# EAGLE schematic 8_step_sequencer (EAGLE 5.10)
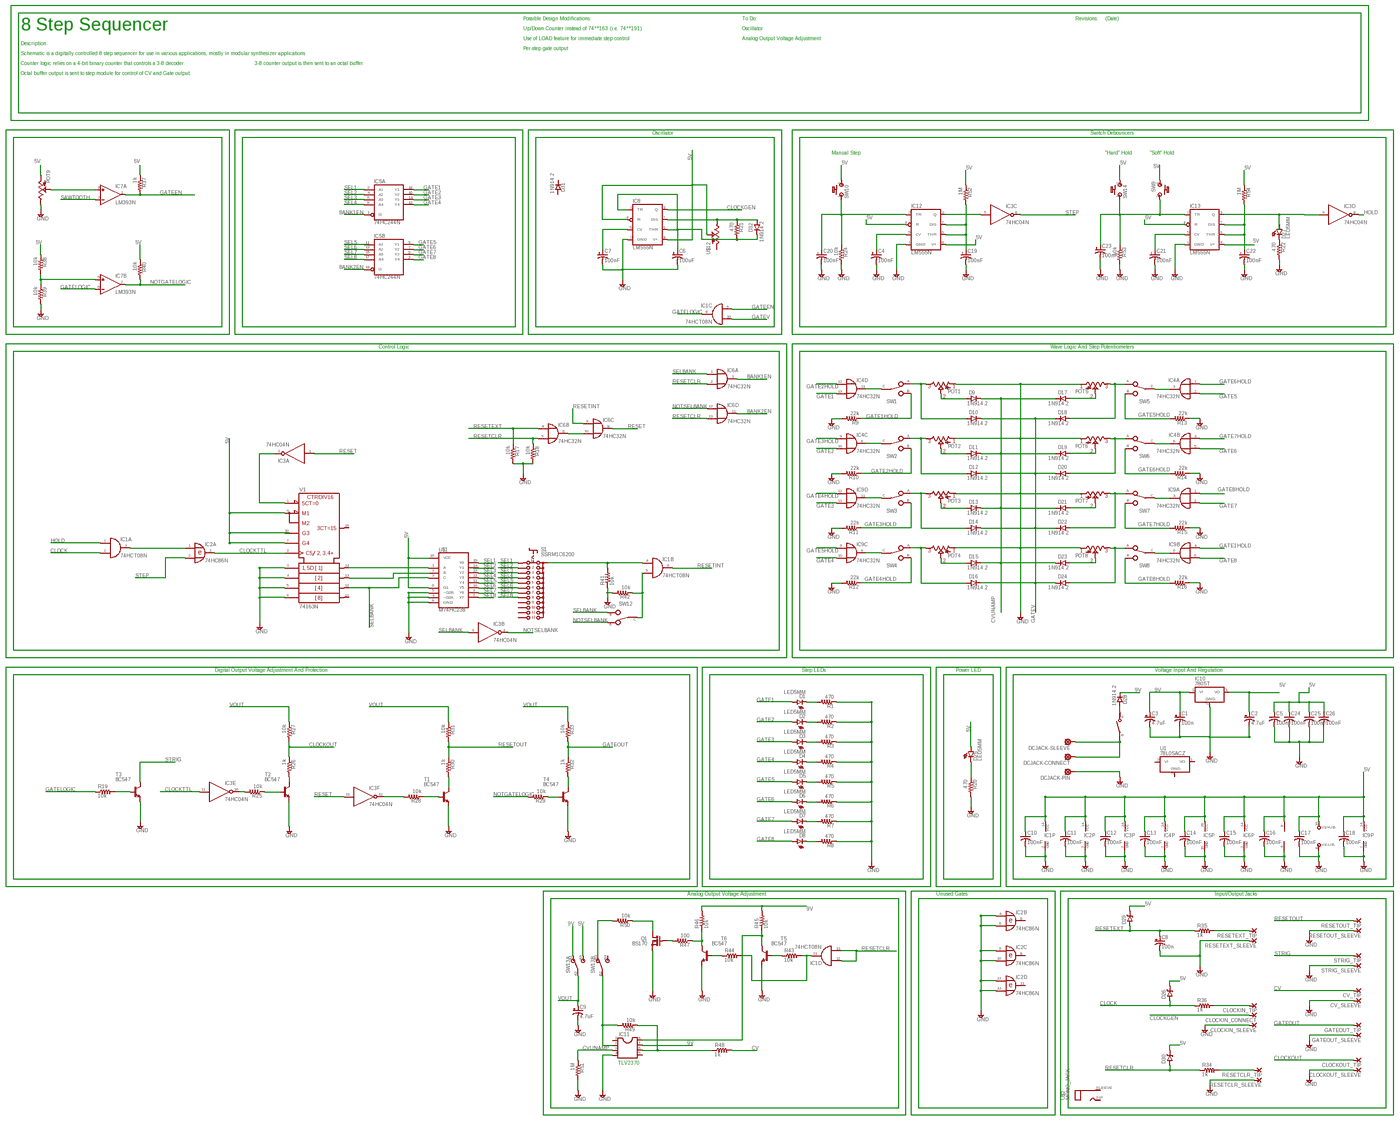
[diagram p0: schematic, sheet 1, overview]
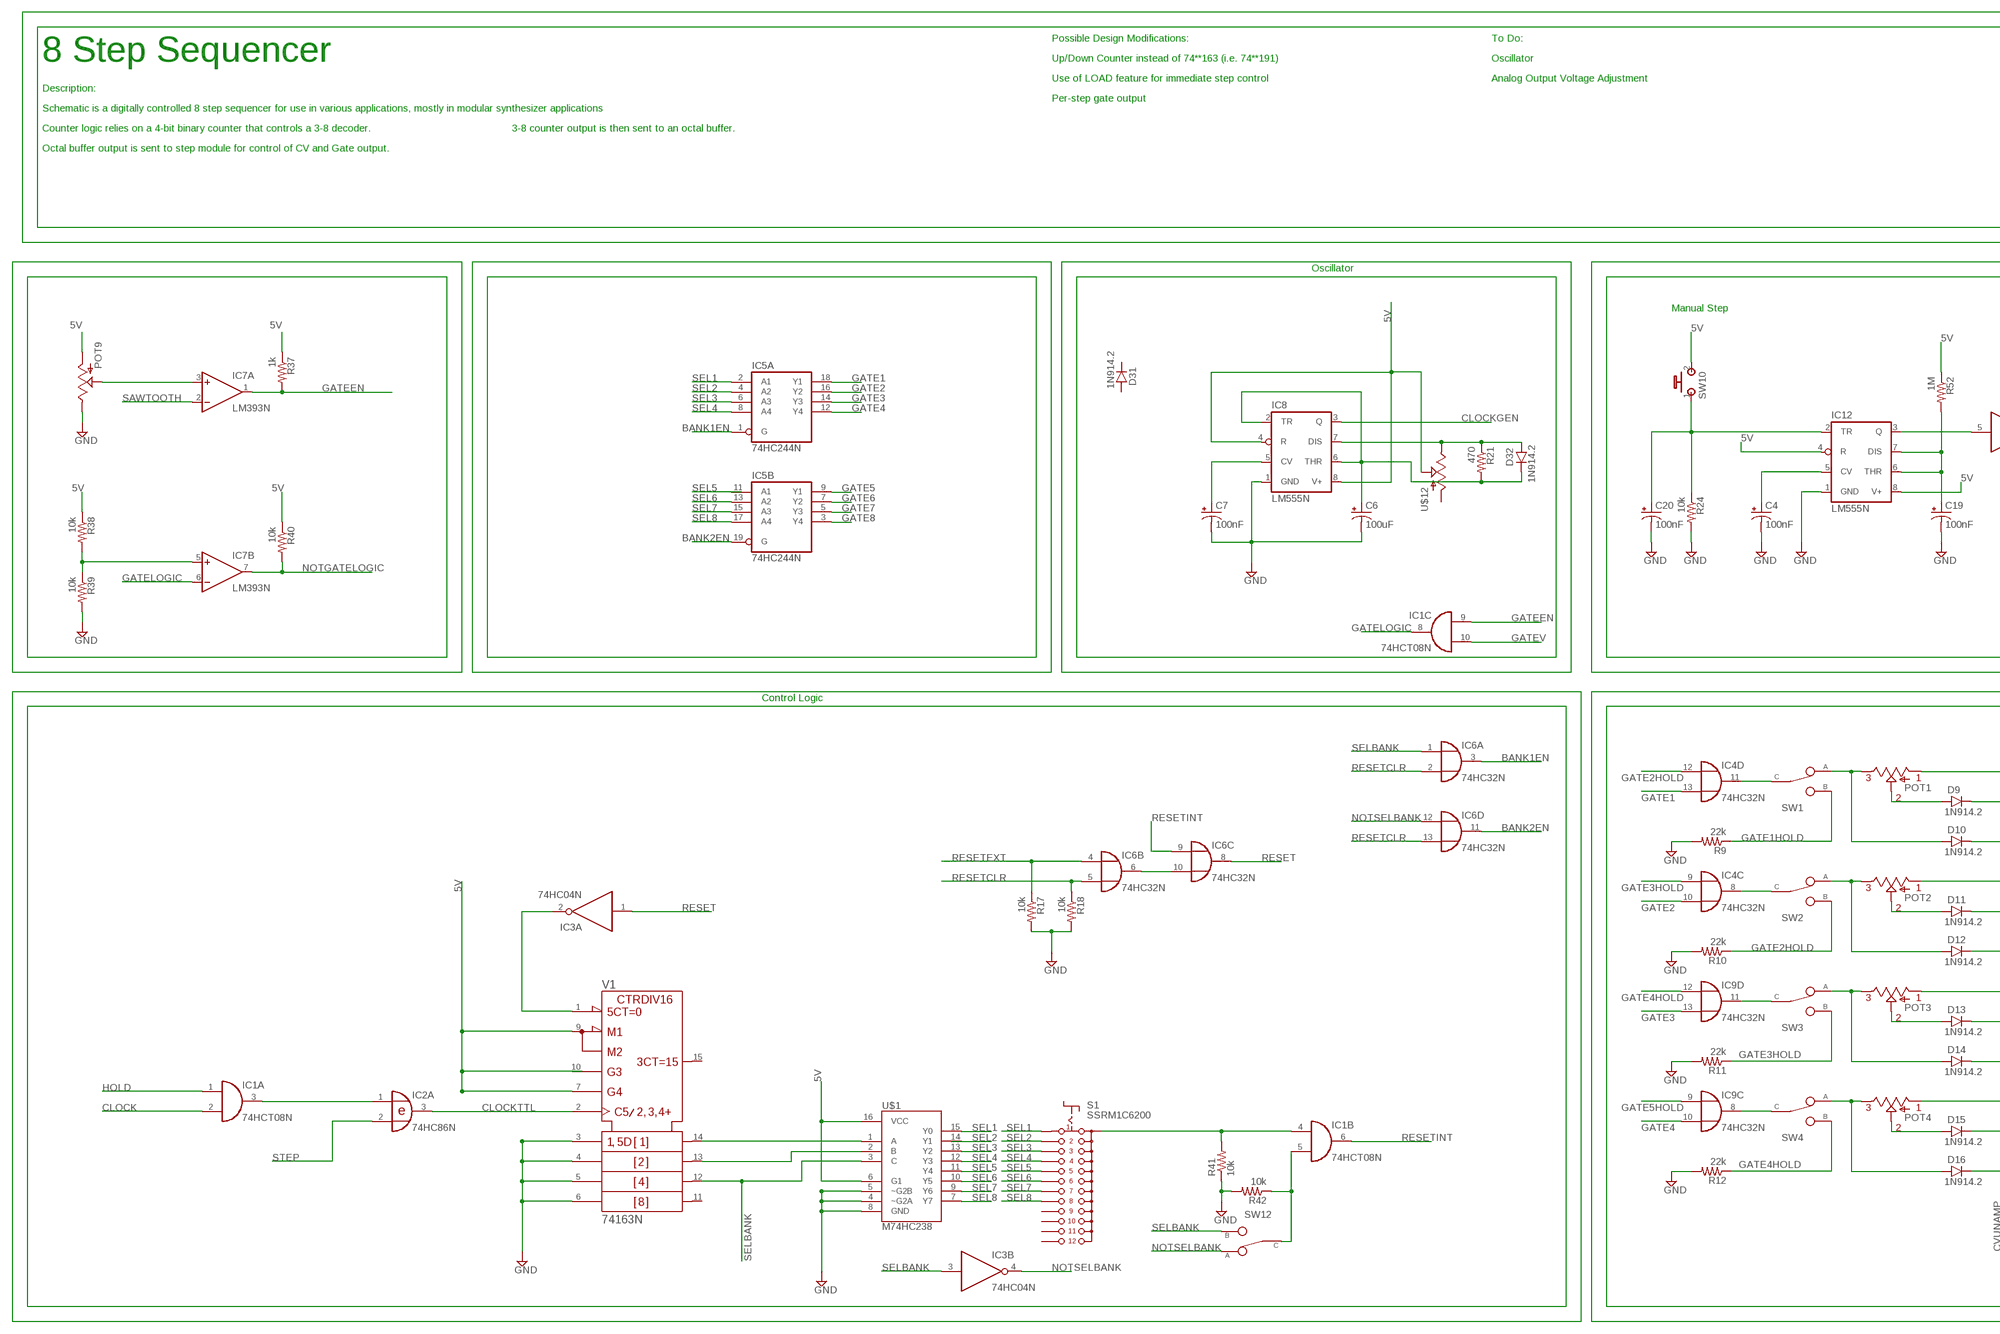
[diagram p1: schematic, sheet 1, part 1 of 4]
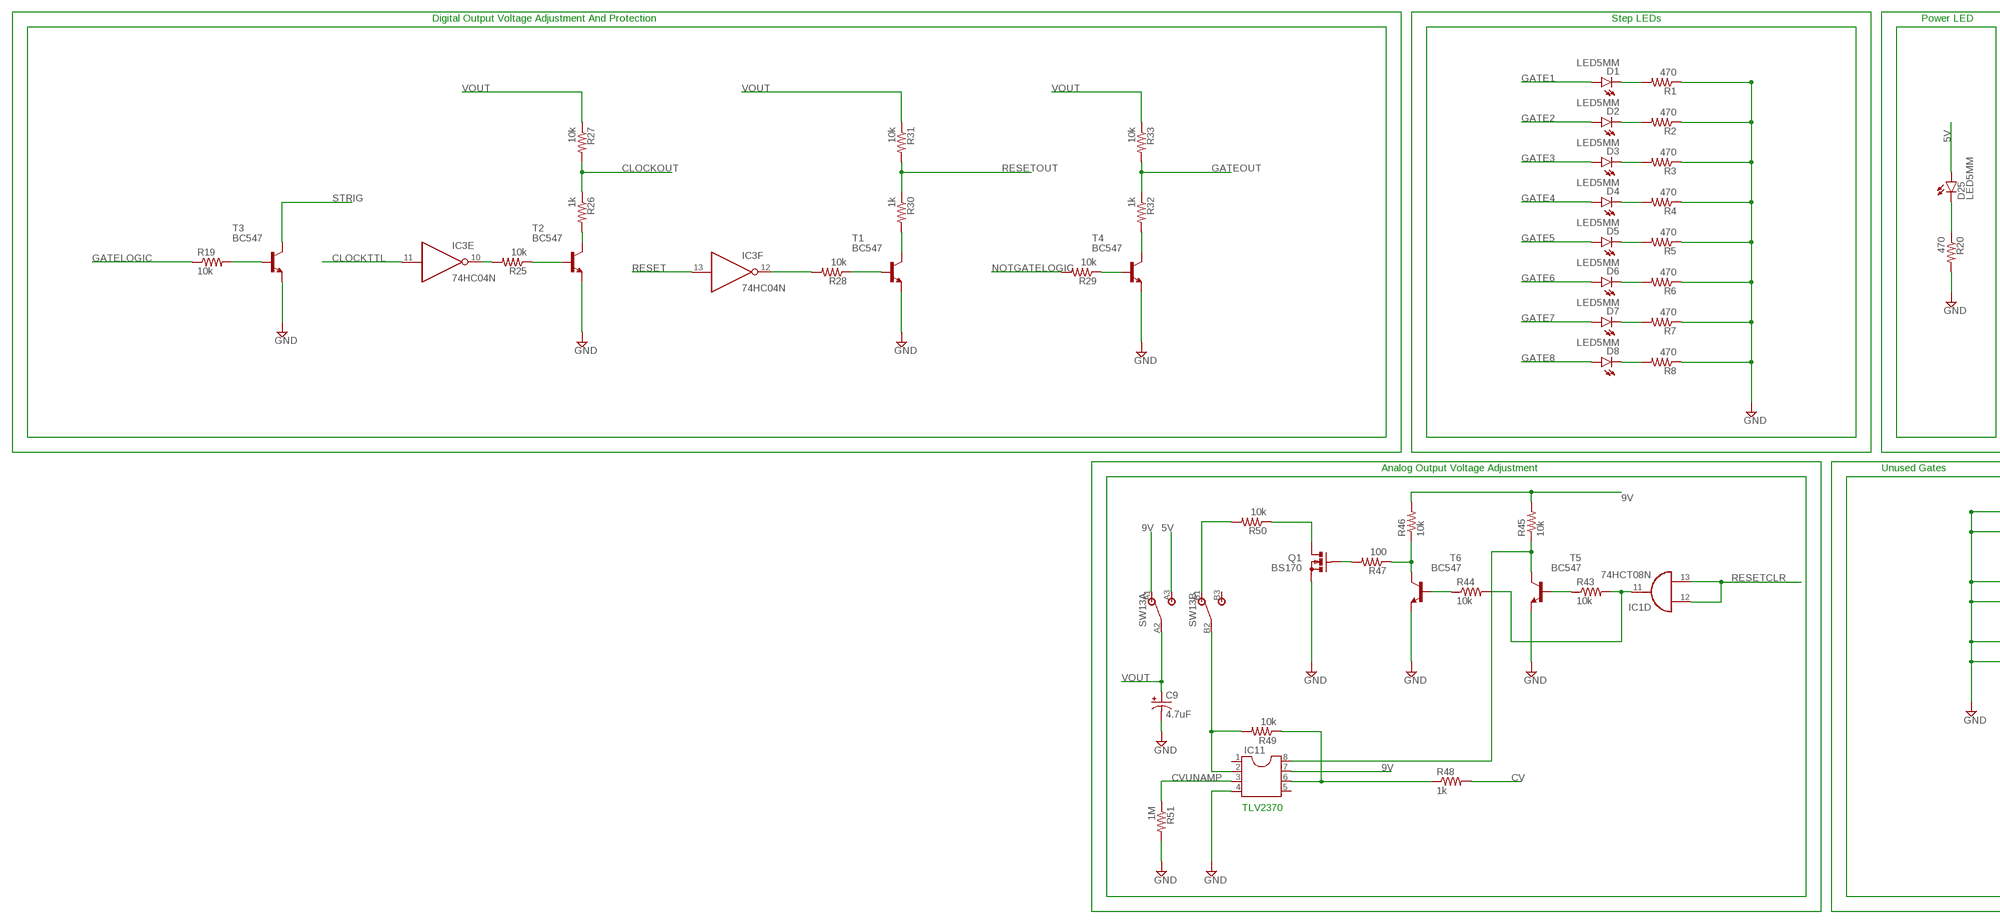
[diagram p2: schematic, sheet 1, part 2 of 4]
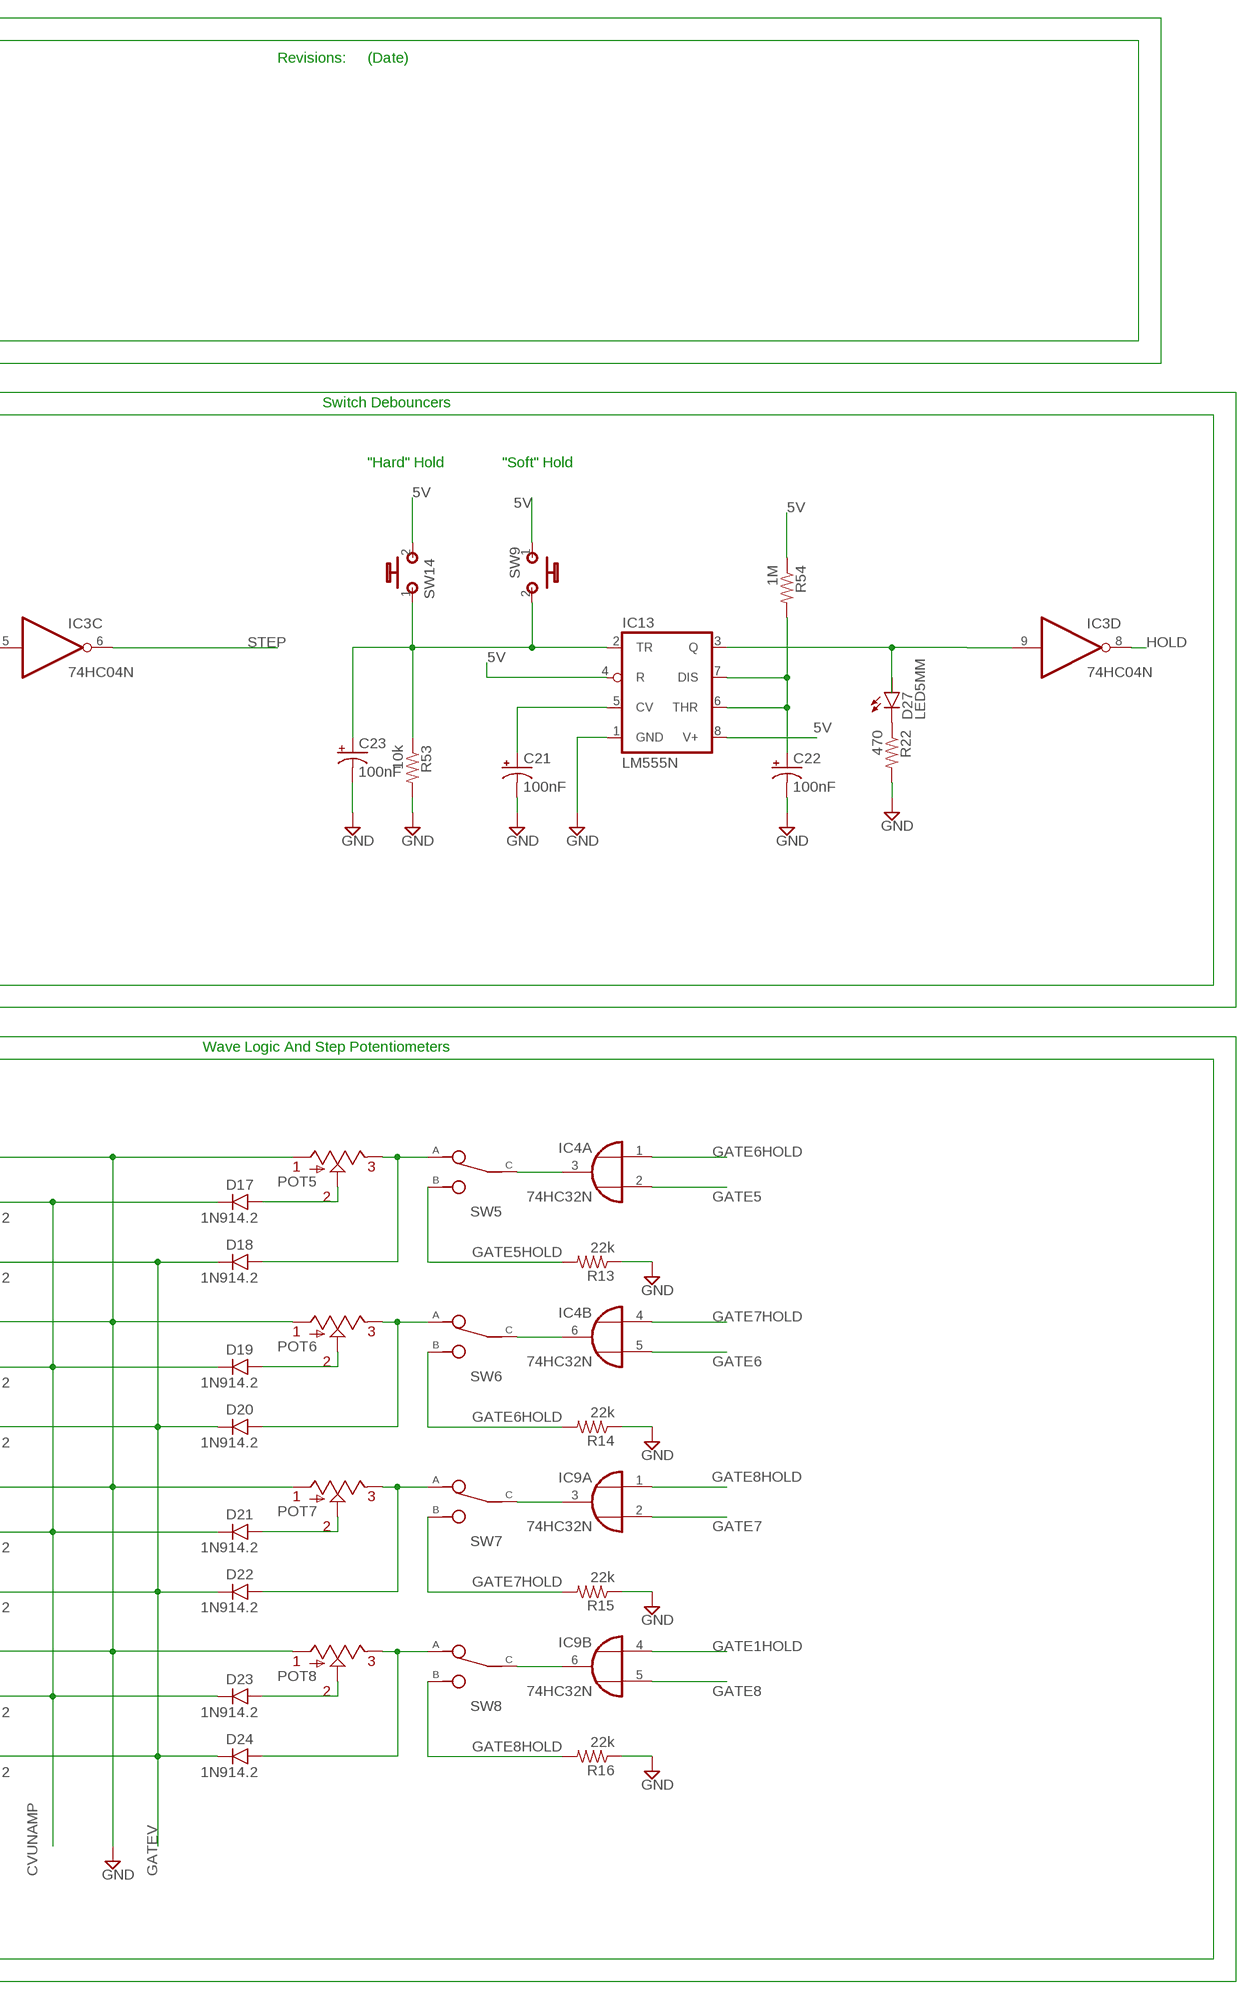
[diagram p3: schematic, sheet 1, part 3 of 4]
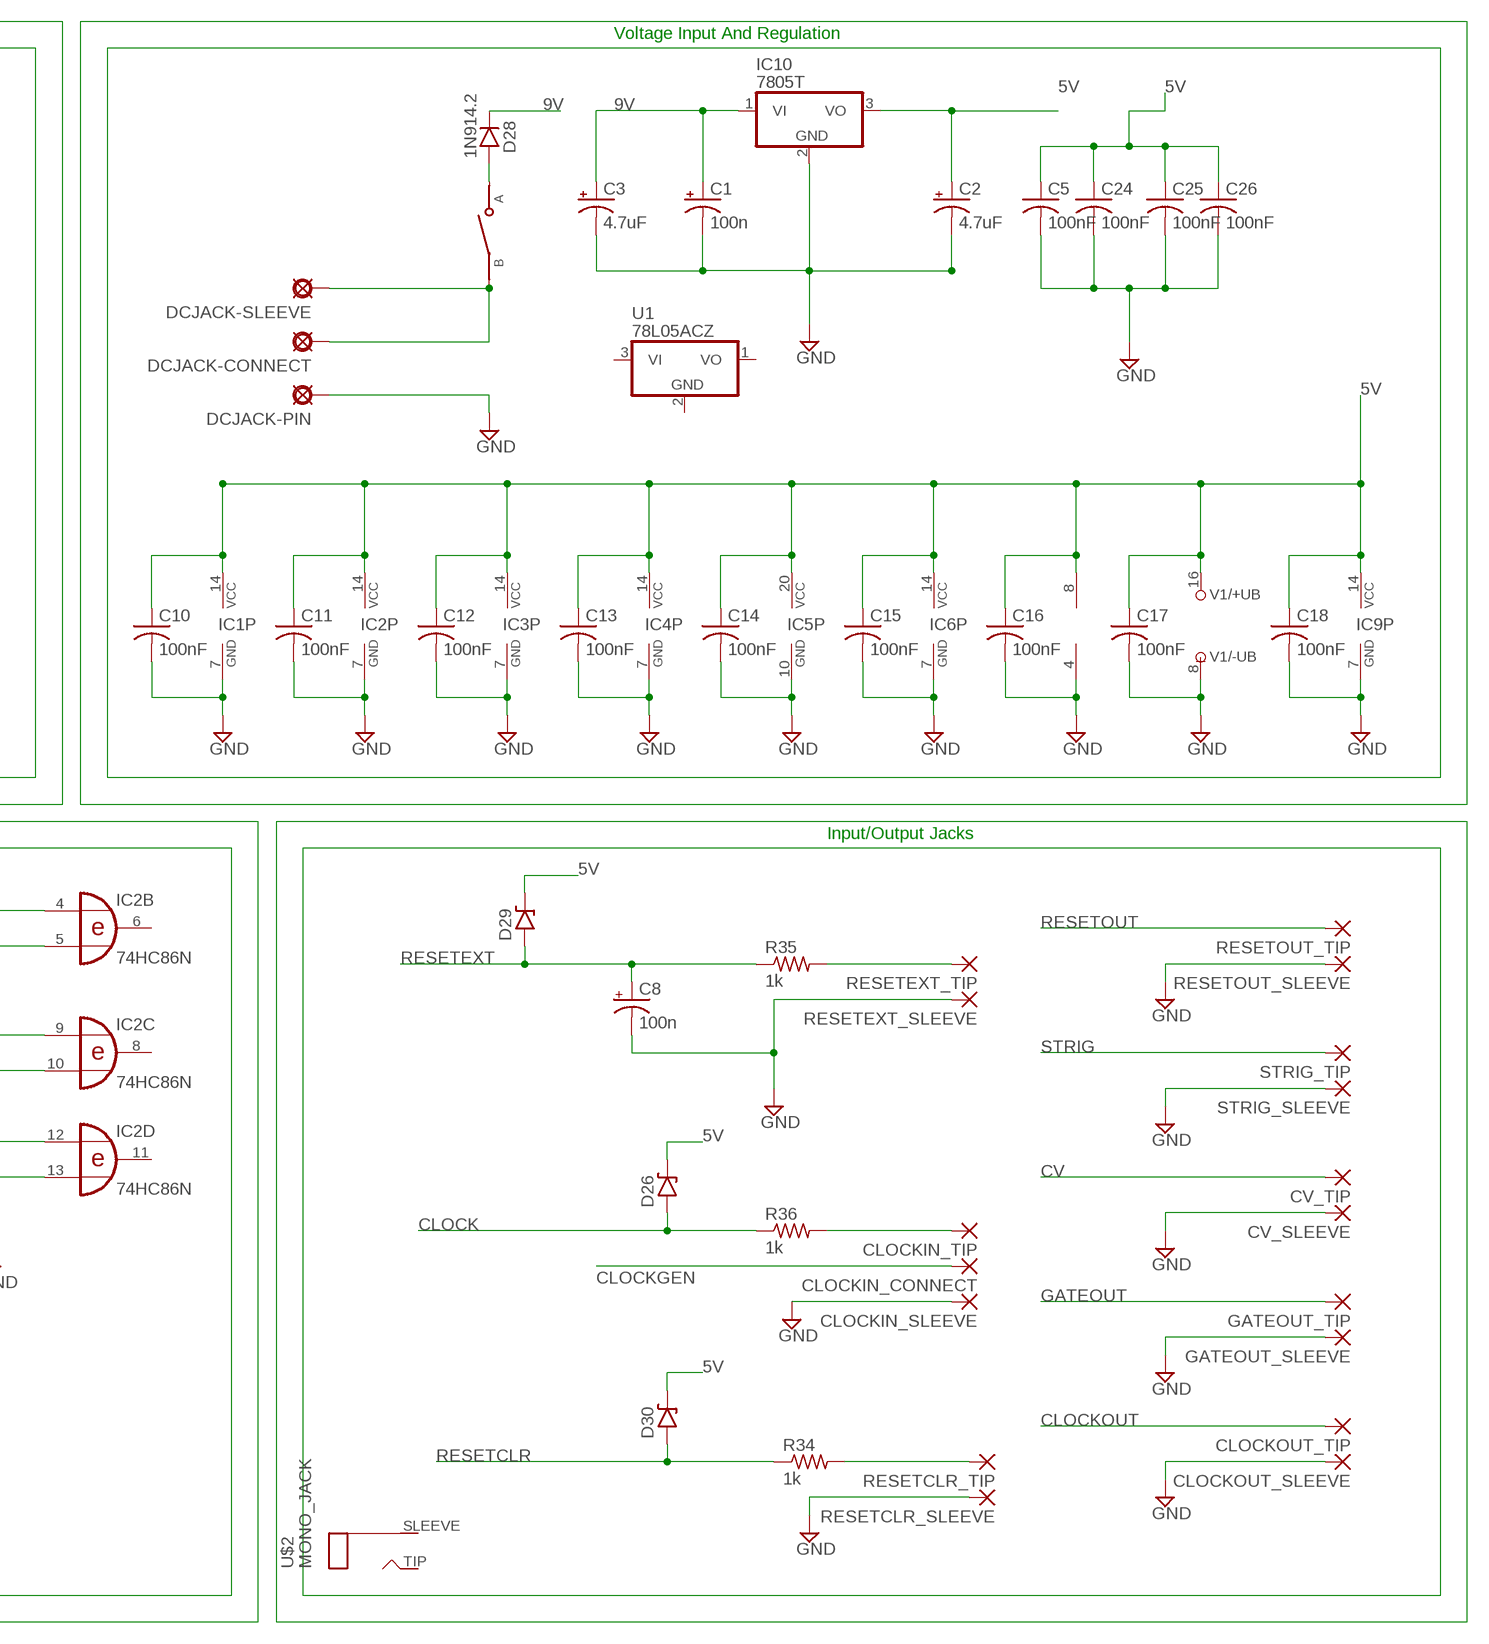
[diagram p4: schematic, sheet 1, part 4 of 4]

## Parts
C1  100n  0501  [050_020_1]
C2  4.7uF  0501  [050_020_1]
C3  4.7uF  0501  [050_020_1]
C4  100nF  0501  [050_020_1]
C5  100nF  C-US050-025X075  [C050-025X075]
C6  100uF  0501  [050_020_1]
C7  100nF  0501  [050_020_1]
C8  100n  0501  [050_020_1]
C9  4.7uF  0501  [050_020_1]
C10  100nF  C-US050-025X075  [C050-025X075]
C11  100nF  C-US050-025X075  [C050-025X075]
C12  100nF  C-US050-025X075  [C050-025X075]
C13  100nF  C-US050-025X075  [C050-025X075]
C14  100nF  C-US050-025X075  [C050-025X075]
C15  100nF  C-US050-025X075  [C050-025X075]
C16  100nF  C-US050-025X075  [C050-025X075]
C17  100nF  C-US050-025X075  [C050-025X075]
C18  100nF  C-US050-025X075  [C050-025X075]
C19  100nF  0501  [050_020_1]
C20  100nF  0501  [050_020_1]
C21  100nF  0501  [050_020_1]
C22  100nF  0501  [050_020_1]
C23  100nF  0501  [050_020_1]
C24  100nF  C-US050-025X075  [C050-025X075]
C25  100nF  C-US050-025X075  [C050-025X075]
C26  100nF  C-US050-025X075  [C050-025X075]
CLOCKIN_CONNECT  3,81/1,4  [3,81/1,4]
CLOCKIN_SLEEVE  3,81/1,4  [3,81/1,4]
CLOCKIN_TIP  3,81/1,4  [3,81/1,4]
CLOCKOUT_SLEEVE  3,81/1,4  [3,81/1,4]
CLOCKOUT_TIP  3,81/1,4  [3,81/1,4]
CV_SLEEVE  3,81/1,4  [3,81/1,4]
CV_TIP  3,81/1,4  [3,81/1,4]
D1  LED5MM  [LED5MM]
D2  LED5MM  [LED5MM]
D3  LED5MM  [LED5MM]
D4  LED5MM  [LED5MM]
D5  LED5MM  [LED5MM]
D6  LED5MM  [LED5MM]
D7  LED5MM  [LED5MM]
D8  LED5MM  [LED5MM]
D9  1N914.2  [DO35-2]
D10  1N914.2  [DO35-2]
D11  1N914.2  [DO35-2]
D12  1N914.2  [DO35-2]
D13  1N914.2  [DO35-2]
D14  1N914.2  [DO35-2]
D15  1N914.2  [DO35-2]
D16  1N914.2  [DO35-2]
D17  1N914.2  [DO35-2]
D18  1N914.2  [DO35-2]
D19  1N914.2  [DO35-2]
D20  1N914.2  [DO35-2]
D21  1N914.2  [DO35-2]
D22  1N914.2  [DO35-2]
D23  1N914.2  [DO35-2]
D24  1N914.2  [DO35-2]
D25  LED5MM  [LED5MM]
D26  1N9ZENER  [DO35-3]
D27  LED5MM  [LED5MM]
D28  1N914.2  [DO35-2]
D29  1N9ZENER  [DO35-3]
D30  1N9ZENER  [DO35-3]
D31  1N914.2  [DO35-2]
D32  1N914.2  [DO35-2]
DCJACK-CONNECT  PAD  [SQUARE]
DCJACK-PIN  PAD8  [OCTOGON]
DCJACK-SLEEVE  PAD  [SQUARE]
GATEOUT_SLEEVE  3,81/1,4  [3,81/1,4]
GATEOUT_TIP  3,81/1,4  [3,81/1,4]
IC1  74HCT08N  [DIL14]
IC2  74HC86N  [DIL14]
IC3  74HC04N  [DIL14]
IC4  74HC32N  [DIL14]
IC5  74HC244N  [DIL20]
IC6  74HC32N  [DIL14]
IC7  LM393N  [DIL08]
IC8  LM555N  [DIL08]
IC9  74HC32N  [DIL14]
IC10  7805T  [TO220H]
IC11  DIL8  [DIL08]
IC12  LM555N  [DIL08]
IC13  LM555N  [DIL08]
POT1  POT  [POT]
POT2  POT  [POT]
POT3  POT  [POT]
POT4  POT  [POT]
POT5  POT  [POT]
POT6  POT  [POT]
POT7  POT  [POT]
POT8  POT  [POT]
POT9  POT  [ALPS_POT]
Q1  BS170  [SOT54ES]
R1  470  3MM.2  [R0204/2]
R2  470  3MM.2  [R0204/2]
R3  470  3MM.2  [R0204/2]
R4  470  3MM.2  [R0204/2]
R5  470  3MM.2  [R0204/2]
R6  470  3MM.2  [R0204/2]
R7  470  3MM.2  [R0204/2]
R8  470  3MM.2  [R0204/2]
R9  22k  3MM.2  [R0204/2]
R10  22k  3MM.2  [R0204/2]
R11  22k  3MM.2  [R0204/2]
R12  22k  3MM.2  [R0204/2]
R13  22k  3MM.2  [R0204/2]
R14  22k  3MM.2  [R0204/2]
R15  22k  3MM.2  [R0204/2]
R16  22k  3MM.2  [R0204/2]
R17  10k  3MM.2  [R0204/2]
R18  10k  3MM.2  [R0204/2]
R19  10k  3MM.2  [R0204/2]
R20  470  3MM.2  [R0204/2]
R21  470  3MM.2  [R0204/2]
R22  470  3MM.2  [R0204/2]
R24  10k  3MM.2  [R0204/2]
R25  10k  3MM.2  [R0204/2]
R26  1k  3MM.2  [R0204/2]
R27  10k  3MM.2  [R0204/2]
R28  10k  3MM.2  [R0204/2]
R29  10k  3MM.2  [R0204/2]
R30  1k  3MM.2  [R0204/2]
R31  10k  3MM.2  [R0204/2]
R32  1k  3MM.2  [R0204/2]
R33  10k  3MM.2  [R0204/2]
R34  1k  3MM.2  [R0204/2]
R35  1k  3MM.2  [R0204/2]
R36  1k  3MM.2  [R0204/2]
R37  1k  3MM.2  [R0204/2]
R38  10k  3MM.2  [R0204/2]
R39  10k  3MM.2  [R0204/2]
R40  10k  3MM.2  [R0204/2]
R41  10k  3MM.2  [R0204/2]
R42  10k  3MM.2  [R0204/2]
R43  10k  3MM.2  [R0204/2]
R44  10k  3MM.2  [R0204/2]
R45  10k  3MM.2  [R0204/2]
R46  10k  3MM.2  [R0204/2]
R47  100  3MM.2  [R0204/2]
R48  1k  3MM.2  [R0204/2]
R49  10k  3MM.2  [R0204/2]
R50  10k  3MM.2  [R0204/2]
R51  1M  3MM.2  [R0204/2]
R52  1M  3MM.2  [R0204/2]
R53  10k  3MM.2  [R0204/2]
R54  1M  3MM.2  [R0204/2]
RESETCLR_SLEEVE  3,81/1,4  [3,81/1,4]
RESETCLR_TIP  3,81/1,4  [3,81/1,4]
RESETEXT_SLEEVE  3,81/1,4  [3,81/1,4]
RESETEXT_TIP  3,81/1,4  [3,81/1,4]
RESETOUT_SLEEVE  3,81/1,4  [3,81/1,4]
RESETOUT_TIP  3,81/1,4  [3,81/1,4]
S1  SSRM1C6200  [SSRM1C6200]
STRIG_SLEEVE  3,81/1,4  [3,81/1,4]
STRIG_TIP  3,81/1,4  [3,81/1,4]
SW1  SPDT_SWITCH  [SPDT_TOGGLE_SWITCH]
SW2  SPDT_SWITCH  [SPDT_TOGGLE_SWITCH]
SW3  SPDT_SWITCH  [SPDT_TOGGLE_SWITCH]
SW4  SPDT_SWITCH  [SPDT_TOGGLE_SWITCH]
SW5  SPDT_SWITCH  [SPDT_TOGGLE_SWITCH]
SW6  SPDT_SWITCH  [SPDT_TOGGLE_SWITCH]
SW7  SPDT_SWITCH  [SPDT_TOGGLE_SWITCH]
SW8  SPDT_SWITCH  [SPDT_TOGGLE_SWITCH]
SW9  MOMENTARY  [SPST]
SW10  MOMENTARY  [SPST]
SW11  SPST_SWITCH  [SPST_TOGGLE_SWITCH]
SW12  SPDT_SWITCH  [SPDT_TOGGLE_SWITCH]
SW13  DPDT  [DPDT]
SW14  MOMENTARY  [SPST]
T1  BC547  [TO92]
T2  BC547  [TO92]
T3  BC547  [TO92]
T4  BC547  [TO92]
T5  BC547  [TO92]
T6  BC547  [TO92]
U1  78L05ACZ  [TO-92]
U$1  M74HC238  [DIL16]
U$2  MONO_JACK  [MONO_JACK]
U$12  POT  [ALPS_POT]
V1  74163N  [DIL16]

## Nets
5V: C2.+ C5.1 C10.1 C11.1 C12.1 C13.1 C14.1 C15.1 C16.1 C17.1 C18.1 C24.1 C25.1 C26.1 D25.A D26.C D29.C D30.C IC1.14(P:VCC) IC2.14(P:VCC) IC3.14(P:VCC) IC4.14(P:VCC) IC5.20(P:VCC) IC6.14(P:VCC) IC7.8(P:V+) IC8.4(R) IC8.8(V+) IC9.14(P:VCC) IC10.3(VO) IC12.4(R) IC12.8(V+) IC13.4(R) IC13.8(V+) POT9.P$3(A) R37.1 R38.1 R40.1 R52.1 R54.1 SW9.1(P) SW10.2(S) SW13.A3 SW14.2(S) U$1.6(G1) U$1.16(VCC) U$12.P$2(S) V1.7(ENP) V1.9(!LOAD) V1.10(ENT) V1.16(+UB)
9V: C1.+ C3.+ D28.C IC10.1(VI) IC11.7 R45.2 R46.2 SW13.A1
9V_IN: DCJACK-CONNECT.1(PAD) DCJACK-SLEEVE.1(PAD) SW11.B
A: U$1.1(A) V1.14(QA)
B: U$1.2(B) V1.13(QB)
BANK1EN: IC5.1(A:G) IC6.3(A:O)
BANK2EN: IC5.19(B:G) IC6.11(D:O)
CLOCK: D26.A IC1.2(A:I1) R36.1
CLOCKGEN: CLOCKIN_CONNECT.1(P) IC8.3(Q)
CLOCKOUT: CLOCKOUT_TIP.1(P) R26.1 R27.2
CLOCKTTL: IC2.3(A:O) IC3.11(E:I) V1.2(CLK)
CV: CV_TIP.1(P) R48.2
CVUNAMP: D9.C D11.C D13.C D15.C D17.C D19.C D21.C D23.C IC11.3 R51.1
GATE1: D1.A IC4.13(D:I1) IC5.18(A:Y1)
GATE1HOLD: IC9.4(B:I0) R9.1 SW1.B
GATE2: D2.A IC4.10(C:I1) IC5.16(A:Y2)
GATE2HOLD: IC4.12(D:I0) R10.1 SW2.B
GATE3: D3.A IC5.14(A:Y3) IC9.13(D:I1)
GATE3HOLD: IC4.9(C:I0) R11.1 SW3.B
GATE4: D4.A IC5.12(A:Y4) IC9.10(C:I1)
GATE4HOLD: IC9.12(D:I0) R12.1 SW4.B
GATE5: D5.A IC4.2(A:I1) IC5.9(B:Y1)
GATE5HOLD: IC9.9(C:I0) R13.2 SW5.B
GATE6: D6.A IC4.5(B:I1) IC5.7(B:Y2)
GATE6HOLD: IC4.1(A:I0) R14.2 SW6.B
GATE7: D7.A IC5.5(B:Y3) IC9.2(A:I1)
GATE7HOLD: IC4.4(B:I0) R15.2 SW7.B
GATE8: D8.A IC5.3(B:Y4) IC9.5(B:I1)
GATE8HOLD: IC9.1(A:I0) R16.2 SW8.B
GATEEN: IC1.9(C:I0) IC7.1(A:OUT) R37.2
GATELOGIC: IC1.8(C:O) IC7.6(B:-IN) R19.1
GATEOUT: GATEOUT_TIP.1(P) R32.1 R33.2
GATEV: D10.C D14.C D16.C D18.C D20.C D22.C D24.C IC1.10(C:I1)
GND: C1.- C2.- C3.- C4.- C5.2 C6.- C7.- C8.- C9.- C10.2 C11.2 C12.2 C13.2 C14.2 C15.2 C16.2 C17.2 C18.2 C19.- C20.- C21.- C22.- C23.- C24.2 C25.2 C26.2 CLOCKIN_SLEEVE.1(P) CLOCKOUT_SLEEVE.1(P) CV_SLEEVE.1(P) DCJACK-PIN.1(PAD) GATEOUT_SLEEVE.1(P) IC1.7(P:GND) IC2.4(B:I0) IC2.5(B:I1) IC2.7(P:GND) IC2.9(C:I0) IC2.10(C:I1) IC2.12(D:I0) IC2.13(D:I1) IC3.7(P:GND) IC4.7(P:GND) IC5.10(P:GND) IC6.7(P:GND) IC7.4(P:V-) IC8.1(GND) IC9.7(P:GND) IC10.2(GND) IC11.4 IC12.1(GND) IC13.1(GND) POT1.1 POT2.1 POT3.1 POT4.1 POT5.1 POT6.1 POT7.1 POT8.1 POT9.P$1(E) Q1.S R1.1 R2.1 R3.1 R4.1 R5.1 R6.1 R7.1 R8.1 R9.2 R10.2 R11.2 R12.2 R13.1 R14.1 R15.1 R16.1 R17.2 R18.2 R20.2 R22.2 R24.2 R39.2 R41.1 R42.2 R51.2 R53.2 RESETCLR_SLEEVE.1(P) RESETEXT_SLEEVE.1(P) RESETOUT_SLEEVE.1(P) STRIG_SLEEVE.1(P) T1.1(E) T2.1(E) T3.1(E) T4.1(E) T5.1(E) T6.1(E) U$1.4(~G2A) U$1.5(~G2B) U$1.8(GND) V1.3(A) V1.4(B) V1.5(C) V1.6(D) V1.8(-UB)
HOLD: IC1.1(A:I0) IC3.8(D:O)
N$1: D1.K(C) R1.2
N$2: IC4.11(D:O) SW1.C
N$3: D10.A POT1.3 SW1.A
N$4: D2.K(C) R2.2
N$5: D9.A POT1.2
N$6: R34.2 RESETCLR_TIP.1(P)
N$7: D3.K(C) R3.2
N$8: IC4.8(C:O) SW2.C
N$9: IC9.11(D:O) SW3.C
N$10: D4.K(C) R4.2
N$11: D12.A POT2.3 SW2.A
N$12: D11.A POT2.2
N$13: D5.K(C) R5.2
N$14: CLOCKIN_TIP.1(P) R36.2
N$15: D14.A POT3.3 SW3.A
N$16: D6.K(C) R6.2
N$17: D13.A POT3.2
N$18: R35.2 RESETEXT_TIP.1(P)
N$19: D7.K(C) R7.2
N$20: IC9.8(C:O) SW4.C
N$21: D16.A POT4.3 SW4.A
N$22: D8.K(C) R8.2
N$23: D15.A POT4.2
N$24: IC7.5(B:+IN) R38.2 R39.1
N$25: IC4.3(A:O) SW5.C
N$26: D18.A POT5.3 SW5.A
N$27: D17.A POT5.2
N$28: D28.A SW11.A
N$29: IC4.6(B:O) SW6.C
N$30: D20.A POT6.3 SW6.A
N$31: D19.A POT6.2
N$33: IC9.3(A:O) SW7.C
N$34: D22.A POT7.3 SW7.A
N$35: D21.A POT7.2
N$36: IC7.3(A:+IN) POT9.P$2(S)
N$37: IC9.6(B:O) SW8.C
N$38: D24.A POT8.3 SW8.A
N$39: D23.A POT8.2
N$40: IC1.5(B:I1) R42.1 SW12.C
N$41: IC1.4(B:I0) R41.2 S1.13(A)
N$42: R44.1 T6.2(B)
N$43: IC6.6(B:O) IC6.10(C:I1)
N$44: R43.1 T5.2(B)
N$45: IC3.2(A:O) V1.1(!CLR)
N$46: IC1.11(D:O) R43.2 R44.2
N$47: IC1.3(A:O) IC2.1(A:I0)
N$48: IC11.8 R45.1 T5.3(C)
N$50: R46.1 R47.1 T6.3(C)
N$51: IC11.6 R48.1 R49.1
N$52: Q1.G R47.2
N$53: IC11.2 R49.2 SW13.B2
N$54: Q1.D R50.1
N$55: D25.K(C) R20.1
N$56: D27.A IC3.9(D:I) IC13.3(Q)
N$57: D27.K(C) R22.1
N$58: R50.2 SW13.B1
N$60: IC3.5(C:I) IC12.3(Q)
N$61: C4.+ IC12.5(CV)
N$62: C6.+ D32.C IC8.2(TR) IC8.6(THR) R21.2
N$63: IC3.10(E:O) R25.2
N$64: R25.1 T2.2(B)
N$65: C7.+ IC8.5(CV)
N$66: D32.A IC8.7(DIS) R21.1 U$12.P$1(E)
N$67: R26.2 T2.3(C)
N$68: IC3.12(F:O) R28.2
N$69: R19.2 T3.2(B)
N$70: R28.1 T1.2(B)
N$71: R30.2 T1.3(C)
N$72: R29.1 T4.2(B)
N$73: R32.2 T4.3(C)
N$74: C19.+ IC12.6(THR) IC12.7(DIS) R52.2
N$75: C20.+ IC12.2(TR) R24.1 SW10.1(P)
N$77: C21.+ IC13.5(CV)
N$78: C23.+ IC13.2(TR) R53.1 SW9.2(S) SW14.1(P)
N$79: C22.+ IC13.6(THR) IC13.7(DIS) R54.2
NOTGATELOGIC: IC7.7(B:OUT) R29.2 R40.2
NOTSELBANK: IC3.4(B:O) IC6.12(D:I0) SW12.A
RESET: IC3.1(A:I) IC3.13(F:I) IC6.8(C:O)
RESETCLR: D30.A IC1.12(D:I0) IC1.13(D:I1) IC6.2(A:I1) IC6.5(B:I1) IC6.13(D:I1) R18.1 R34.1
RESETEXT: C8.+ D29.A IC6.4(B:I0) R17.1 R35.1
RESETINT: IC1.6(B:O) IC6.9(C:I0)
RESETOUT: R30.1 R31.2 RESETOUT_TIP.1(P)
SAWTOOTH: IC7.2(A:-IN)
SEL1: IC5.2(A:A1) S1.1 U$1.15(Y0)
SEL2: IC5.4(A:A2) S1.2 U$1.14(Y1)
SEL3: IC5.6(A:A3) S1.3 U$1.13(Y2)
SEL4: IC5.8(A:A4) S1.4 U$1.12(Y3)
SEL5: IC5.11(B:A1) S1.5 U$1.11(Y4)
SEL6: IC5.13(B:A2) S1.6 U$1.10(Y5)
SEL7: IC5.15(B:A3) S1.7 U$1.9(Y6)
SEL8: IC5.17(B:A4) S1.8 U$1.7(Y7)
SELBANK: IC3.3(B:I) IC6.1(A:I0) SW12.B U$1.3(C) V1.12(QC)
STEP: IC2.2(A:I1) IC3.6(C:O)
STRIG: STRIG_TIP.1(P) T3.3(C)
VOUT: C9.+ R27.1 R31.1 R33.1 SW13.A2
Unconnected: D12.C D31.A D31.C IC2.6(B:O) IC2.8(C:O) IC2.11(D:O) IC11.1 IC11.5 S1.9 S1.10 S1.11 S1.12 SW13.B3 U1.1(VO) U1.2(GND) U1.3(VI) U$2.SLEEVE U$2.TIP U$12.P$3(A) V1.11(QD) V1.15(RCO)

## Notes on the sheet
- Possible Design Modifications: | To Do: | Revisions: | (Date)
- 8 Step Sequencer | Up/Down Counter instead of 74**163 (i.e. 74**191) | Oscillator
- Use of LOAD feature for immediate step control | Analog Output Voltage Adjustment
- Description:
- Per-step gate output
- Schematic is a digitally controlled 8 step sequencer for use in various applications, mostly in modular synthesizer applications
- Counter logic relies on a 4-bit binary counter that controls a 3-8 decoder. | 3-8 counter output is then sent to an octal buffer.
- Octal buffer output is sent to step module for control of CV and Gate output.
- Oscillator | Switch Debouncers
- Manual Step | "Hard" Hold | "Soft" Hold
- Control Logic | Wave Logic And Step Potentiometers
- Digital Output Voltage Adjustment And Protection | Step LEDs | Power LED | Voltage Input And Regulation
- Analog Output Voltage Adjustment | Unused Gates | Input/Output Jacks
- TLV2370

## Library data of the parts
C1-C4 C6-C9 C19-C23 = gm-caps-electro-pol:050: 0.22 - 100uF Xicon values at Mouser.com: 10V: 10 - 100uF; 16V: 2.2 - 47uF; 25V: 0.47 - 47uF; 50V: 0.22 - 22uF
C5 C10-C18 C24-C26 = rcl:C-US: CAPACITOR, American symbol
CLOCKIN_CONNECT CLOCKIN_SLEEVE CLOCKIN_TIP CLOCKOUT_SLEEVE CLOCKOUT_TIP CV_SLEEVE CV_TIP GATEOUT_SLEEVE GATEOUT_TIP RESETCLR_SLEEVE RESETCLR_TIP RESETEXT_SLEEVE RESETEXT_TIP RESETOUT_SLEEVE RESETOUT_TIP STRIG_SLEEVE STRIG_TIP = wirepad:3,81/1,4: THROUGH-HOLE PAD
D1-D8 D25 D27 = gm-diodes:LED
D9-D24 D28 D31 D32 = gm-diodes:1N914: Fast Switching Diode DO-35 glass case a.k.a. 1N4148
D26 D29 D30 = gm-diodes:1N9*ZENER: 1N9???B Zener Diode DO-35 case 1N957B - 1N992B (6.8V to 200V)
DCJACK-CONNECT DCJACK-PIN DCJACK-SLEEVE = gm-supply:PAD: PAD use this package for pads with any purpose, including input, output, send or return various pad shapes: round, square, octogonal, long, and long offset
IC1 = 74xx-eu:74*08: Quad 2-input AND gate
IC2 = 74xx-eu:74*86: Quad 2-input EXCLUSIVE-OR (XOR) gate
IC3 = 74xx-eu:74*04: Hex INVERTER
IC4 IC6 IC9 = 74xx-eu:74*32: Quad 2-input OR gate
IC5 = 74xx-eu:74*244: Octal BUFFER and LINE DRIVER, 3-state
IC7 = linear:LM393: COMPARATOR
IC8 IC12 IC13 = linear:*555: TIMER
IC10 = gm-regulators:78*: Positive VOLTAGE REGULATOR Source: http://cache.national.com/ds/LM/LM78L05.pdf http://www.fairchildsemi.com/ds/LM/LM7805.pdf
IC11 = ic-package:DIL8: Dual In Line / Socket
POT1-POT8 = 00_steve:POT
POT9 U$12 = SparkFun:POT
Q1 = gm-trans:BS170: N-CHANNEL MOS FET
R1-R22 R24-R54 = gm-resistors:3MM: 3mm Resistors Leads spaced 1-6 holes apart for 0.1" perfboard. Suitable for 1/8 watt resistors.
S1 = switch:SSRM1: 12-position General-purpose Vertical Type Rotary Switch 1 Pole 12 Positions Source: ALPS - SRRM.pdf
SW1-SW8 SW12 = 00_steve:SPDT_SWITCH: SPDT Switch Part No.: M102 Source: (http://www.led-switch.com)
SW9 SW10 SW14 = gm-switches:MOMENTARY
SW11 = 00_steve:SPST_SWITCH: SPST Switch Part No.: M101 Source: (http://www.led-switch.com)
SW13 = gm-switches:DPDT
T1-T6 = transistor:BC547: NPN TRANSISTOR
U1 = 00_steve:78L05ACZ
U$1 = SparkFun:M74HC238: M74HC238 - CMOS 3 TO 8 LINE DECODER
U$2 = 00_steve:MONO_JACK
V1 = 74ttl-din:74*163: Synchrounus 4-bit COUNTER